# Altium schematic sheet battery_diode-charging.SchDoc: Battery Charging - Ideal Diode
size A4; Date: 2015-09-22; Author: Piotr Kuligowski; DocumentNumber: 1; Revision: 1-0; SheetNumber: 1; SheetTotal: 14; Model: EM1
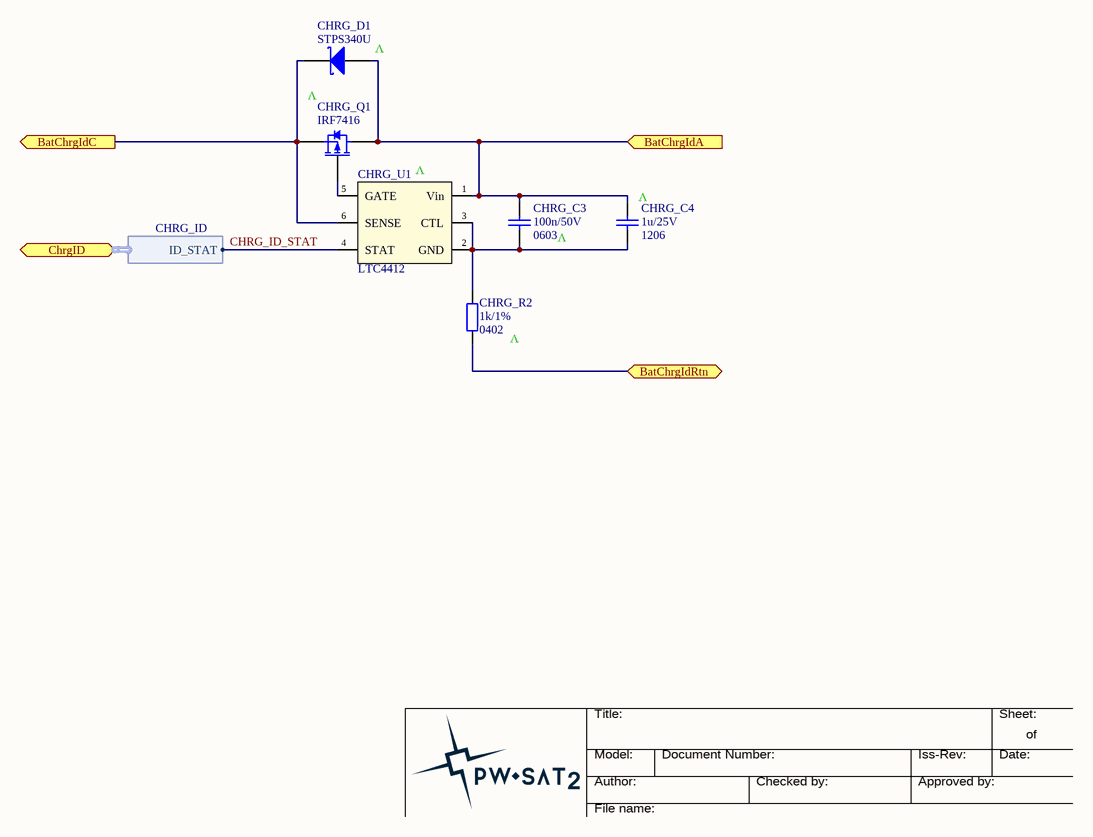
[diagram p0: battery_diode-charging.SchDoc]

## Parts
CHRG_C3  Package: 0603  [SMD_Capacitor_0603]  (hidden comment: 100n/50V)
CHRG_C4  Package: 1206  [SMD_Capacitor_1206]  (hidden comment: 1u/25V)
CHRG_D1  STPS340U  [DO-214AA]
CHRG_Q1  IRF7416  [SOIC-8-N_SSSGDDDD]
CHRG_R2  Package: 0402  [SMD_Resistor_0402]  (hidden comment: 1k/1%)
CHRG_U1  LTC4412  [SOT23-6]

## Ports
BatChrgIdA (in), BatChrgIdC (out), BatChrgIdRtn, ChrgID (harness CHRG_ID)

## Harnesses
CHRG_ID: ID_STAT

## Nets
BatChrgIdA: CHRG_C3.1 CHRG_C4.1 CHRG_D1.A CHRG_Q1.D CHRG_U1.1(Vin) ; port BatChrgIdA
BatChrgIdC: CHRG_D1.K CHRG_Q1.S CHRG_U1.6(SENSE) ; port BatChrgIdC
BatChrgIdRtn: CHRG_R2.2 ; port BatChrgIdRtn
CHRG_ID_STAT: CHRG_U1.4(STAT) ; port ChrgID.ID_STAT
NetCHRG_C3_2: CHRG_C3.2 CHRG_C4.2 CHRG_R2.1 CHRG_U1.2(GND) CHRG_U1.3(CTL)
NetCHRG_Q1_G: CHRG_Q1.G CHRG_U1.5(GATE)

## Notes on the sheet
- (near CHRG_D1) V
- V
- (near CHRG_U1) V
- (near CHRG_C4) V
- (near CHRG_R2) V
- Title:
- Sheet:
- of
- Author:
- Model:
- Document Number:
- Checked by:
- Iss-Rev:
- Approved by:
- Date:
- File name:

## Library data of the parts
CHRG_C3 = Cer_GCJ188R71H104KA12D: Ceramic Cap Murata Automotive 100n/50V X7R 0603; Manufacturer: Murata; ManufacturerPartNumber: GCJ188R71H104KA12D; Value: 100n/50V
CHRG_C4 = Cer_C1206T105K3RALTU: Ceramic Cap Kemet COTS 1u/25V X7R 1206; ManufacturerPartNumber: C1206T105K3RALTU; Manufacturer: Kemet; Value: 1u/25V
CHRG_D1 = STPS340x: 3A/40V Power Schottky Rectifier.; Manufacturer: STMicroelectronics; Value: STPS340U
CHRG_Q1 = IRF7416: 10A/30V HEXFET Power P-MOSFET.; Manufacturer: International Rectifier; Value: IRF7416
CHRG_R2 = CRCW04021K00FKxxxx: 1k/1% Vishay CRCW 0402 Resistor. 63mW, 100ppm, 50V.; Manufacturer: Vishay; ManufacturerPartNumber: CRCW04021K00FKxxxx; Value: 1k/1%
CHRG_U1 = LTC4412: Ideal Diode, Low Loss PowerPath Controller.; Manufacturer: Linear Technology; Value: LTC4412